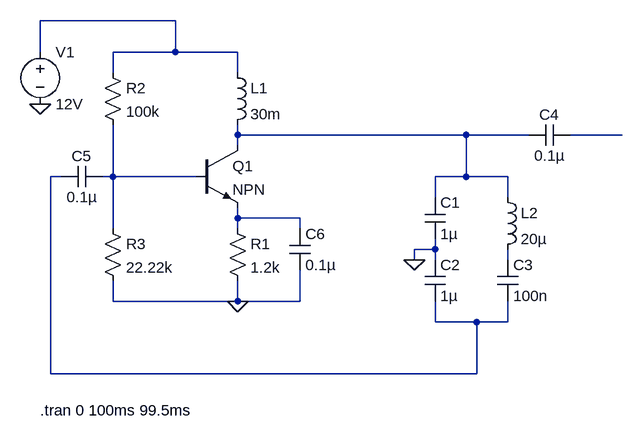
[diagram p0: schematic Clapp.asc]
Clapp.asc, the LTspice schematic file:
Version 4
SHEET 1 4244 728
WIRE 3312 -64 3104 -64
WIRE 3104 -16 3104 -64
WIRE 3312 -16 3312 -64
WIRE 3312 -16 3216 -16
WIRE 3408 -16 3312 -16
WIRE 3216 16 3216 -16
WIRE 3408 16 3408 -16
WIRE 3408 112 3408 96
WIRE 3760 112 3408 112
WIRE 3856 112 3760 112
WIRE 4000 112 3920 112
WIRE 3408 128 3408 112
WIRE 3136 176 3120 176
WIRE 3216 176 3216 96
WIRE 3216 176 3200 176
WIRE 3344 176 3216 176
WIRE 3760 176 3760 112
WIRE 3760 176 3712 176
WIRE 3824 176 3760 176
WIRE 3712 208 3712 176
WIRE 3824 208 3824 176
WIRE 3408 240 3408 224
WIRE 3504 240 3408 240
WIRE 3216 256 3216 176
WIRE 3408 256 3408 240
WIRE 3504 256 3504 240
WIRE 3712 288 3712 272
WIRE 3712 288 3680 288
WIRE 3680 304 3680 288
WIRE 3712 304 3712 288
WIRE 3824 304 3824 288
WIRE 3216 368 3216 336
WIRE 3408 368 3408 336
WIRE 3408 368 3216 368
WIRE 3504 368 3504 320
WIRE 3504 368 3408 368
WIRE 3712 400 3712 368
WIRE 3776 400 3712 400
WIRE 3824 400 3824 368
WIRE 3824 400 3776 400
WIRE 3120 480 3120 176
WIRE 3776 480 3776 400
WIRE 3776 480 3120 480
FLAG 3104 64 0
FLAG 3408 368 0
FLAG 3680 304 0
SYMBOL npn 3344 128 R0
SYMATTR InstName Q1
SYMBOL res 3392 240 R0
SYMATTR InstName R1
SYMATTR Value 1.2k
SYMBOL res 3200 0 R0
SYMATTR InstName R2
SYMATTR Value 100k
SYMBOL res 3200 240 R0
SYMATTR InstName R3
SYMATTR Value 22.22k
SYMBOL voltage 3104 -32 R0
WINDOW 123 0 0 Left 0
WINDOW 39 0 0 Left 0
SYMATTR InstName V1
SYMATTR Value 12V
SYMBOL cap 3696 208 R0
SYMATTR InstName C1
SYMATTR Value 1µ
SYMBOL cap 3696 304 R0
SYMATTR InstName C2
SYMATTR Value 1µ
SYMBOL cap 3808 304 R0
SYMATTR InstName C3
SYMATTR Value 100n
SYMBOL ind 3808 192 R0
SYMATTR InstName L2
SYMATTR Value 20µ
SYMBOL cap 3920 96 R90
WINDOW 0 0 32 VBottom 2
WINDOW 3 32 32 VTop 2
SYMATTR InstName C4
SYMATTR Value 0.1µ
SYMBOL cap 3200 160 R90
WINDOW 0 0 32 VBottom 2
WINDOW 3 32 32 VTop 2
SYMATTR InstName C5
SYMATTR Value 0.1µ
SYMBOL cap 3488 256 R0
SYMATTR InstName C6
SYMATTR Value 0.1µ
SYMBOL ind 3392 0 R0
SYMATTR InstName L1
SYMATTR Value 30m
TEXT 3104 536 Left 2 !.tran 0 100ms 99.5ms

The netlist it stands for:
* Clapp.asc
Q1 N002 N005 N006 0 NPN
R1 N006 0 1.2k
R2 N001 N005 100k
R3 N005 0 22.22k
V1 N001 0 12V
C1 N002 0 1µ
C2 0 N004 1µ
C3 N007 N004 100n
L2 N002 N007 20µ
C4 N003 N002 0.1µ
C5 N005 N004 0.1µ
C6 N006 0 0.1µ
L1 N001 N002 30m
.model NPN NPN
.model PNP PNP
.lib standard.bjt
.tran 0 100ms 99.5ms
.backanno
.end